# Altium project Main.PrjPcb
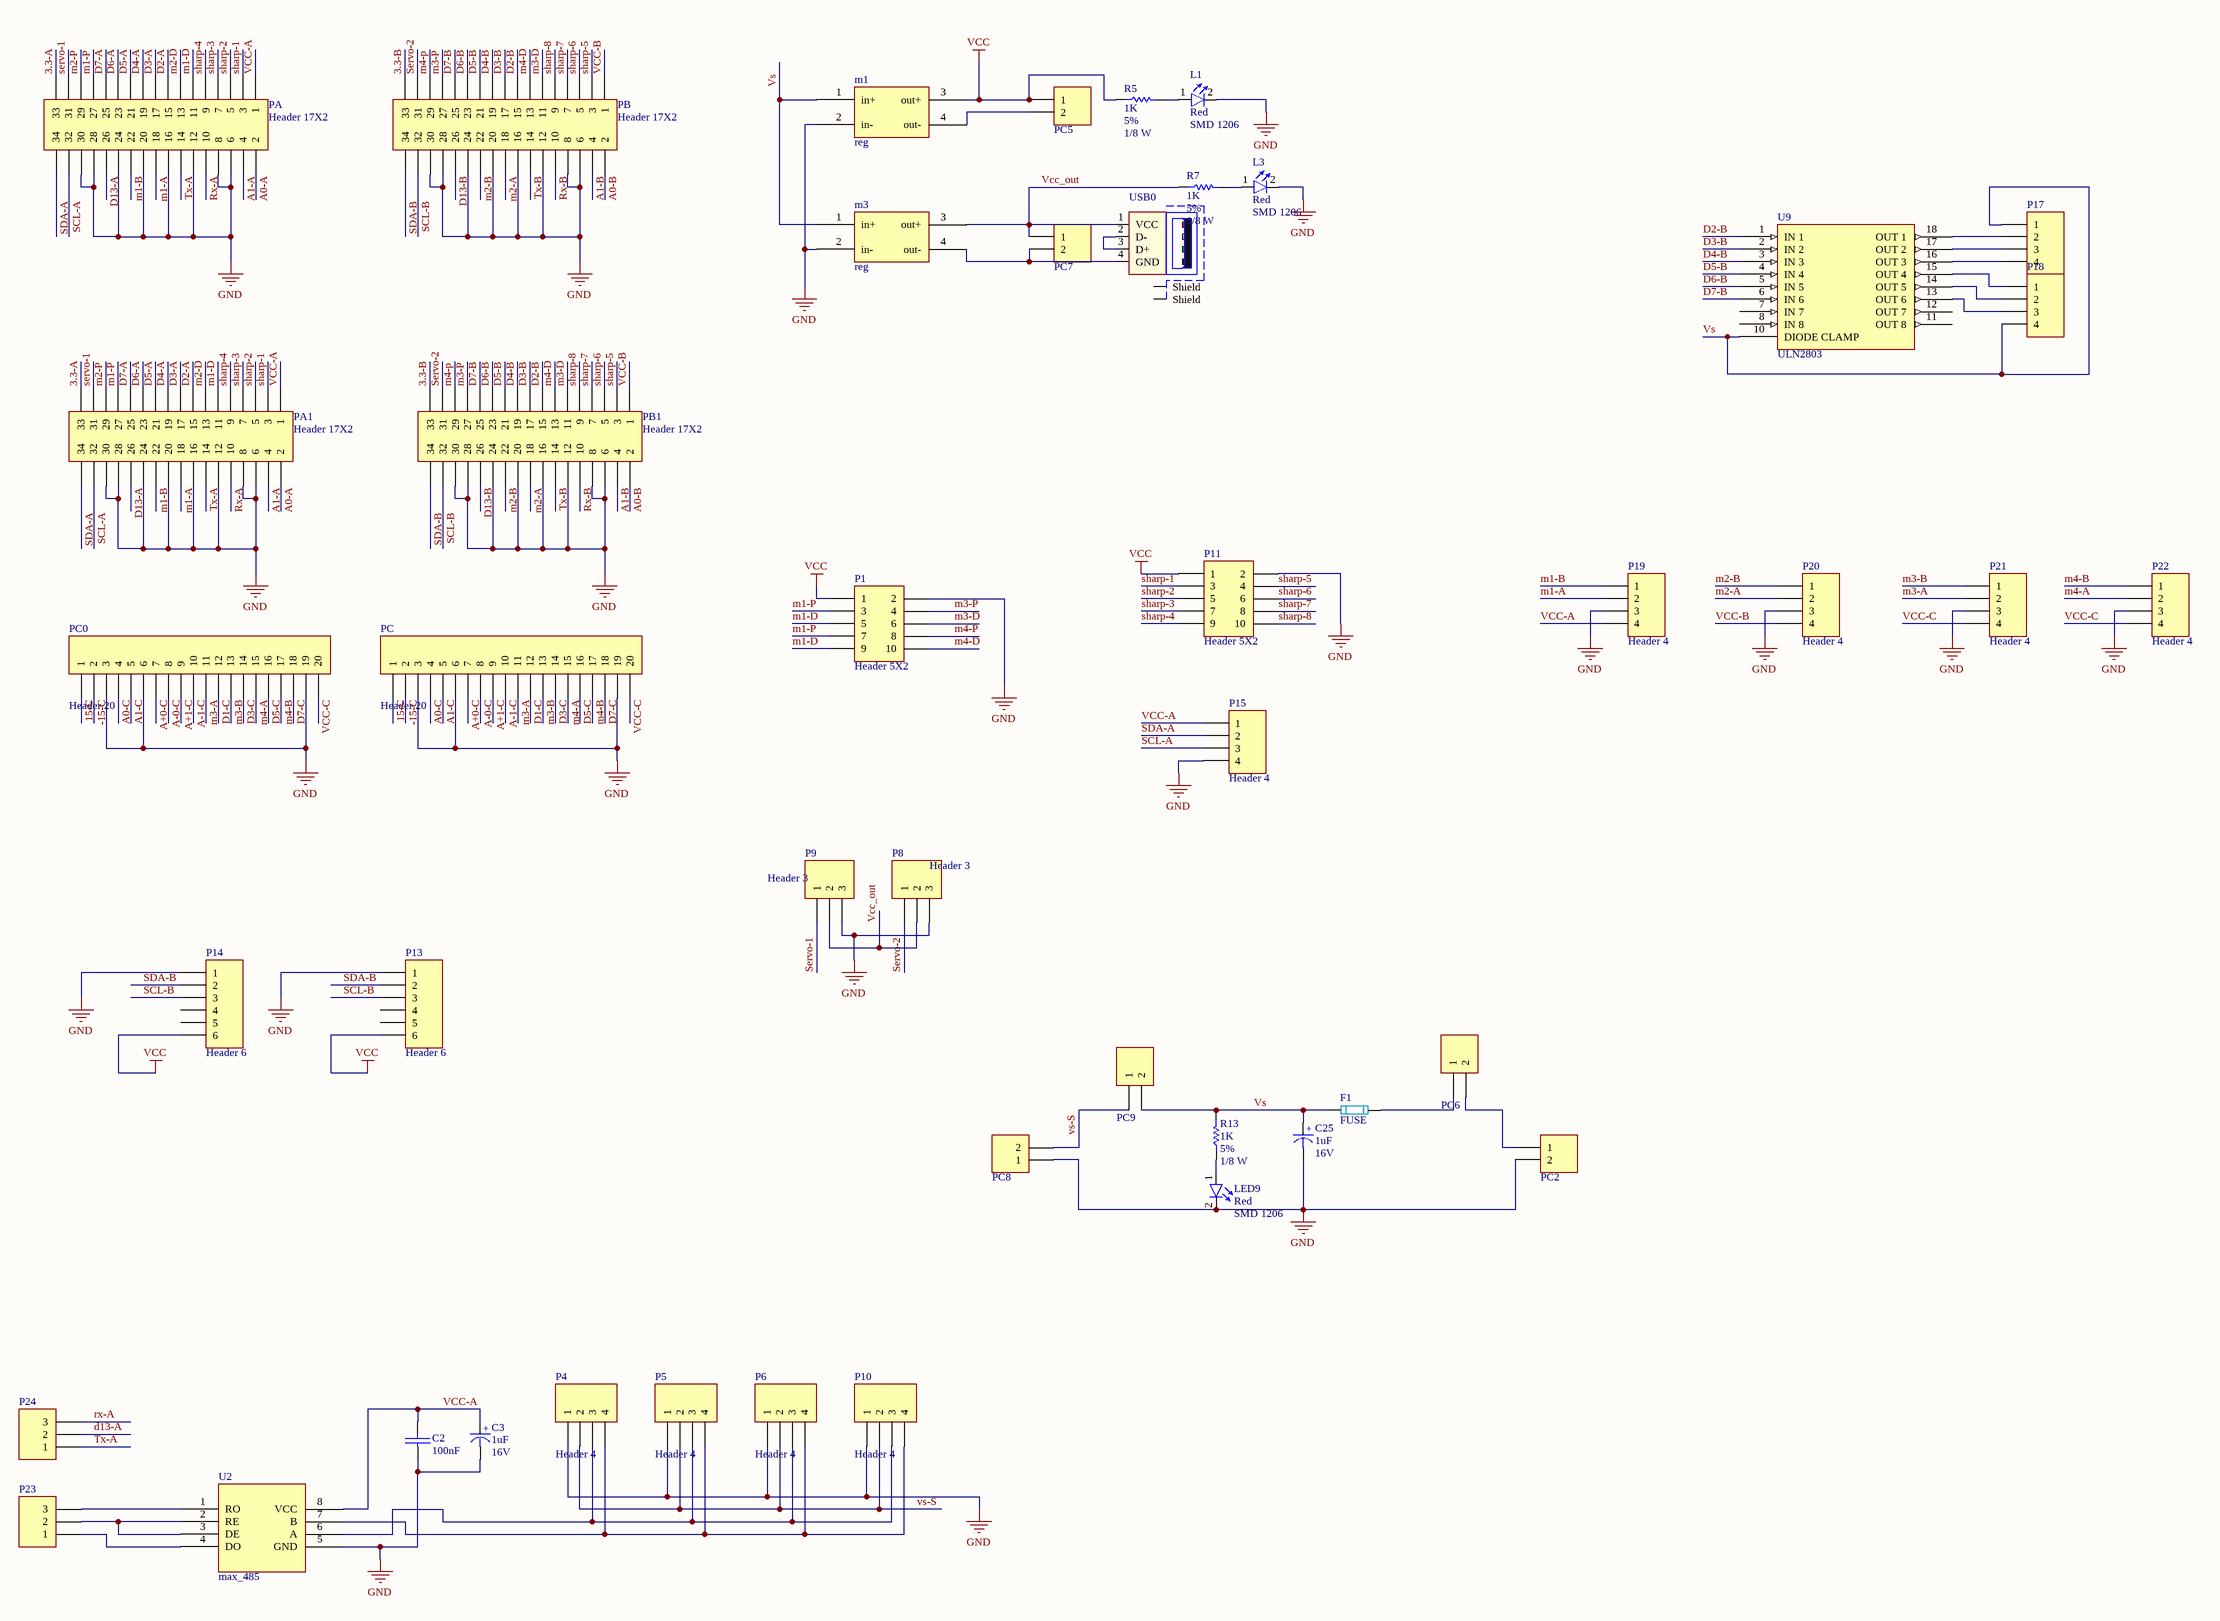
[diagram p0: Main.SchDoc]
1 sheet, 46 parts. Net scope: global (net labels, ports and power ports of the same name join across sheets).
Board file: Main.PcbDoc

## Sheet Main.SchDoc
size A2

### Parts
C2  100nF  [SMD_CAP_1206]
C3  Voltage: 16V  [cap 01]  (hidden comment: 1uF)
C25  Voltage: 16V  [cap 04]  (hidden comment: 1uF)
F1  FUSE  [FUSE_1]
L1  Size: SMD 1206  [LED-3mm]  (hidden comment: Red)
L3  Size: SMD 1206  [LED-3mm]  (hidden comment: Red)
LED9  Size: SMD 1206  [LED-3mm]  (hidden comment: Red)
m1  reg  [reg-module]
m3  reg  [reg-module]
P1  Header 5X2  [HDR2X5]
P4  Header 4  [HDR1X4]
P5  Header 4  [HDR1X4]
P6  Header 4  [HDR1X4]
P8  Header 3  [HDR1X3]
P9  Header 3  [HDR1X3]
P10  Header 4  [HDR1X4]
P11  Header 5X2  [HDR2X5]
P13  Header 6  [HDR1X6]
P14  Header 6  [HDR1X6]
P15  Header 4  [HDR1X4]
P17  Header 4  [My_1X04]  (value not drawn)
P18  Header 4  [My_1X04]  (value not drawn)
P19  Header 4  [HDR1X4]
P20  Header 4  [HDR1X4]
P21  Header 4  [HDR1X4]
P22  Header 4  [HDR1X4]
P23  Header 3  [My_1X03]  (value not drawn)
P24  Header 3  [My_1X03]  (value not drawn)
PA  Header 17X2  [HDR2X17]
PA1  Header 17X2  [HDR2X17]
PB  Header 17X2  [HDR2X17]
PB1  Header 17X2  [HDR2X17]
PC  Header 20  [HDR1X20]
PC0  Header 20  [HDR1X20]
PC2  Power Connector  [My_ Power_Connector]  (value not drawn)
PC5  Power Connector  [My_ Power_Connector]  (value not drawn)
PC6  Power Connector  [My_ Power_Connector]  (value not drawn)
PC7  Power Connector  [My_ Power_Connector]  (value not drawn)
PC8  Power Connector  [My_ Power_Connector]  (value not drawn)
PC9  Power Connector  [My_ Power_Connector]  (value not drawn)
R5  Tolerance: 5%  Power: 1/8 W  [Res-(1/4)]  (hidden comment: 1K)
R7  Tolerance: 5%  Power: 1/8 W  [Res-(1/4)]  (hidden comment: 1K)
R13  Tolerance: 5%  Power: 1/8 W  [Res-(1/4)]  (hidden comment: 1K)
U2  max_485  [PCBComponent_1]
U9  ULN2803  [My_DIP-18]
USB0  (no value)  [61400416021]

### Nets
GND: C2.2(-) C3.2(-) C25.2(-) L1.2(K) L3.2(K) LED9.2(K) m1.2(in-) m3.2(in-) P1.2 P4.1 P5.1 P6.1 P8.3 P9.3 P10.1 P11.2 P13.1 P14.1 P15.4 P19.3 P20.3 P21.3 P22.3 PA.6 PA.8 PA.12 PA.16 PA.20 PA.24 PA.28 PA.30 PA1.6 PA1.8 PA1.12 PA1.16 PA1.20 PA1.24 PA1.28 PA1.30 PB.6 PB.8 PB.12 PB.16 PB.20 PB.24 PB.28 PB.30 PB1.6 PB1.8 PB1.12 PB1.16 PB1.20 PB1.24 PB1.28 PB1.30 PC.3 PC.6 PC.19 PC0.3 PC0.6 PC0.19 PC2.2 PC8.1 U2.5(GND) U9.9(GND)
VCC: m1.3(out+) P1.1 P11.1 P13.6 P14.6 PC5.1 R5.1
3.3-A: PA.33 PA1.33
3.3-B: PB.33 PB1.33
15-C: PC.1 PC0.1
-15-C: PC.2 PC0.2
A0-A: PA.2 PA1.2
A0-B: PB.2 PB1.2
A0-C: PC.4 PC0.4
A1-A: PA.4 PA1.4
A1-B: PB.4 PB1.4
A1-C: PC.5 PC0.5
A+0-C: PC.7 PC0.7
A+1-C: PC.9 PC0.9
A-0-C: PC.8 PC0.8
A-1-C: PC.10 PC0.10
D1-C: PC.12 PC0.12
D2-A: PA.15 PA1.15
D2-B: PB.15 PB1.15 U9.1(IN_1)
D3-A: PA.17 PA1.17
D3-B: PB.17 PB1.17 U9.2(IN_2)
D3-C: PC.14 PC0.14
D4-A: PA.19 PA1.19
D4-B: PB.19 PB1.19 U9.3(IN_3)
D5-A: PA.21 PA1.21
D5-B: PB.21 PB1.21 U9.4(IN_4)
D5-C: PC.16 PC0.16
D6-A: PA.23 PA1.23
D6-B: PB.23 PB1.23 U9.5(IN_5)
D7-A: PA.25 PA1.25
D7-B: PB.25 PB1.25 U9.6(IN_6)
D7-C: PC.18 PC0.18
D13-A: P24.2 PA.26 PA1.26
D13-B: PB.26 PB1.26
m1-A: P19.2 PA.18 PA1.18
m1-B: P19.1 PA.22 PA1.22
m1-D: P1.5 P1.9 PA.11 PA1.11
m1-P: P1.3 P1.7 PA.27 PA1.27
m2-A: P20.2 PB.18 PB1.18
m2-B: P20.1 PB.22 PB1.22
m2-D: PA.13 PA1.13
m2-P: PA.29 PA1.29
m3-A: P21.2 PC.11 PC0.11
m3-B: P21.1 PC.13 PC0.13
m3-D: P1.6 PB.11 PB1.11
m3-P: P1.4 PB.27 PB1.27
m4-A: P22.2 PC.15 PC0.15
m4-B: P22.1 PC.17 PC0.17
m4-D: P1.10 PB.13 PB1.13
m4-P: P1.8 PB.29 PB1.29
Rx-A: P24.3 PA.10 PA1.10
Rx-B: PB.10 PB1.10
SCL-A: P15.3 PA.32 PA1.32
SCL-B: P13.3 P14.3 PB.32 PB1.32
SDA-A: P15.2 PA.34 PA1.34
SDA-B: P13.2 P14.2 PB.34 PB1.34
Servo-1: P9.1 PA.31 PA1.31
Servo-2: P8.1 PB.31 PB1.31
sharp-1: P11.3 PA.3 PA1.3
sharp-2: P11.5 PA.5 PA1.5
sharp-3: P11.7 PA.7 PA1.7
sharp-4: P11.9 PA.9 PA1.9
sharp-5: P11.4 PB.3 PB1.3
sharp-6: P11.6 PB.5 PB1.5
sharp-7: P11.8 PB.7 PB1.7
sharp-8: P11.10 PB.9 PB1.9
Tx-A: P24.1 PA.14 PA1.14
Tx-B: PB.14 PB1.14
VCC-A: C2.1(+) C3.1(+) P15.1 P19.4 PA.1 PA1.1 U2.8(VCC)
VCC-B: P20.4 PB.1 PB1.1
VCC-C: P21.4 P22.4 PC.20 PC0.20
Vcc_out: m3.3(out+) P8.2 P9.2 PC7.1 R7.1 USB0.1(VCC)
Vs: C25.1(+) F1.1 m1.1(in+) m3.1(in+) P17.1 P18.4 PC9.2 R13.2 U9.10(DIODE_CLAMP)
vs-S: P4.2 P5.2 P6.2 P10.2 PC8.2 PC9.1
NetF1_2: F1.2 PC6.1
NetL1_1: L1.1(A) R5.2
NetL3_1: L3.1(A) R7.2
NetLED9_1: LED9.1(A) R13.1
Netm1_4: m1.4(out-) PC5.2
Netm3_4: m3.4(out-) PC7.2 USB0.4(GND)
NetP4_3: P4.3 P5.3 P6.3 P10.3 U2.6(A)
NetP4_4: P4.4 P5.4 P6.4 P10.4 U2.7(B)
NetP17_2: P17.2 U9.18(OUT_1)
NetP17_3: P17.3 U9.17(OUT_2)
NetP17_4: P17.4 U9.16(OUT_3)
NetP18_1: P18.1 U9.15(OUT_4)
NetP18_2: P18.2 U9.14(OUT_5)
NetP18_3: P18.3 U9.13(OUT_6)
NetP23_1: P23.1 U2.4(DO)
NetP23_2: P23.2 U2.2(RE) U2.3(DE)
NetP23_3: P23.3 U2.1(RO)
NetPC2_1: PC2.1 PC6.2
NetUSB0_2: USB0.2(D-) USB0.3(D+)

Not connected (* = marked no-connect by the designer): P13 4 5; P14 4 5; U9 7(IN_7) 8(IN_8) 11(OUT_8) 12(OUT_7); USB0 Z1(Shield) Z2(Shield)

### Library data of the parts
C2 = Cap-Bipolar: Bipolar Capacitor; Voltage: 100V; Designer: Saeid Jorablo; Organazation: ControTec; Adding Date: 1387/12/20; Value: 100nF
C3 C25 = Cap-Polar: Polar Capacitor; Designer: Saeid Jorablo; Organazation: ControTec; Adding Date: 1387/12/20; Value: 1uF
L1 L3 LED9 = LED: Designer: Saeid Jorablo; Organazation: ControTec; Adding Date: 1387/12/22; Color: Red
m1 m3 = Component_1
P1 P11 = Header 5X2: Header, 5-Pin, Dual row; LatestRevisionDate: 17-Jul-2002; LatestRevisionNote: Re-released for DXP Platform.; Publisher: Altium Limited
P4-P6 P10 P15 P17-P22 = Header 4: Header, 4-Pin; LatestRevisionDate: 17-Jul-2002; LatestRevisionNote: Re-released for DXP Platform.; Publisher: Altium Limited
P8 P9 P23 P24 = Header 3: Header, 3-Pin; LatestRevisionDate: 17-Jul-2002; LatestRevisionNote: Re-released for DXP Platform.; Publisher: Altium Limited
P13 P14 = Header 6: Header, 6-Pin; LatestRevisionDate: 17-Jul-2002; LatestRevisionNote: Re-released for DXP Platform.; Publisher: Altium Limited
PA PA1 PB PB1 = Header 17X2: Header, 17-Pin, Dual row; LatestRevisionDate: 17-Jul-2002; LatestRevisionNote: Re-released for DXP Platform.; Publisher: Altium Limited
PC PC0 = Header 20: Header, 20-Pin; LatestRevisionDate: 17-Jul-2002; LatestRevisionNote: Re-released for DXP Platform.; Publisher: Altium Limited
PC2 PC5-PC9 = Power Connector: white Power Connector
R5 R7 R13 = Resistor: Value: 1K
U9 = ULN2803: HIGH-VOLTAGE,HIGH-CURRENT DARLINTON ARRAYS
USB0 = WE-Communication Connectors 61400416021: WR-COM USB RA Type A; Manufacturer: Würth Elektronik eiSos GmbH; ComponentLink1 Description: Manufacturer; ComponentLink2 Description: Datasheet; NoPins: 4; ComponentLink1URL: http://www.we-online.de; ComponentLink2URL: http://katalog.we-online.de/em/datasheet/61400416021.pdf; Created by: Karrer Zheng; Created Date: 10/10/2014; partNo: 61400416021